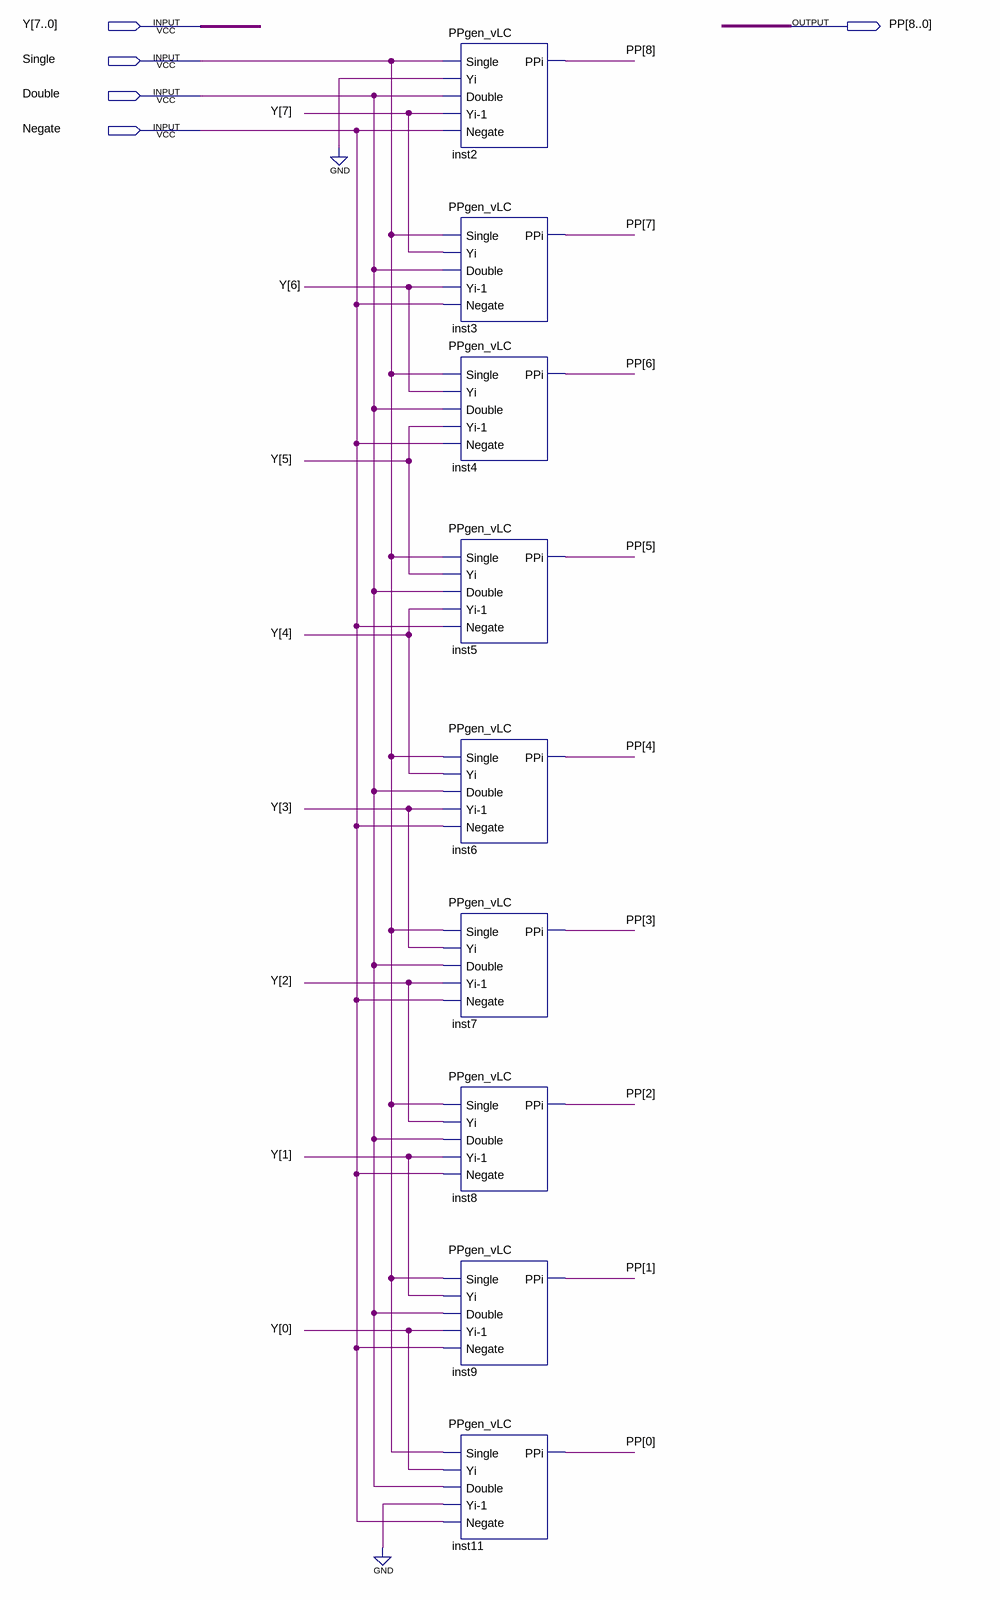
[diagram p0: schematic sheet]
// Quartus schematic PPgen_9bits_vLC.bdf as structural Verilog: 9 symbols, 5 pins
module PPgen_9bits_vLC (
  input  [7:0] Y,
  input  Single,
  input  Double,
  input  Negate,
  output [8:0] PP
);

  PPgen_vLC inst2 (.Single(Single), .Yi(1'b0), .Double(Double), .\Yi-1 (Y[7]), .Negate(Negate), .PPi(PP[8]));
  PPgen_vLC inst3 (.Single(Single), .Yi(Y[7]), .Double(Double), .\Yi-1 (Y[6]), .Negate(Negate), .PPi(PP[7]));
  PPgen_vLC inst4 (.Single(Single), .Yi(Y[6]), .Double(Double), .\Yi-1 (Y[5]), .Negate(Negate), .PPi(PP[6]));
  PPgen_vLC inst5 (.Single(Single), .Yi(Y[5]), .Double(Double), .\Yi-1 (Y[4]), .Negate(Negate), .PPi(PP[5]));
  PPgen_vLC inst6 (.Single(Single), .Yi(Y[4]), .Double(Double), .\Yi-1 (Y[3]), .Negate(Negate), .PPi(PP[4]));
  PPgen_vLC inst7 (.Single(Single), .Yi(Y[3]), .Double(Double), .\Yi-1 (Y[2]), .Negate(Negate), .PPi(PP[3]));
  PPgen_vLC inst8 (.Single(Single), .Yi(Y[2]), .Double(Double), .\Yi-1 (Y[1]), .Negate(Negate), .PPi(PP[2]));
  PPgen_vLC inst9 (.Single(Single), .Yi(Y[1]), .Double(Double), .\Yi-1 (Y[0]), .Negate(Negate), .PPi(PP[1]));
  PPgen_vLC inst11 (.Single(Single), .Yi(Y[0]), .Double(Double), .\Yi-1 (1'b0), .Negate(Negate), .PPi(PP[0]));
endmodule
